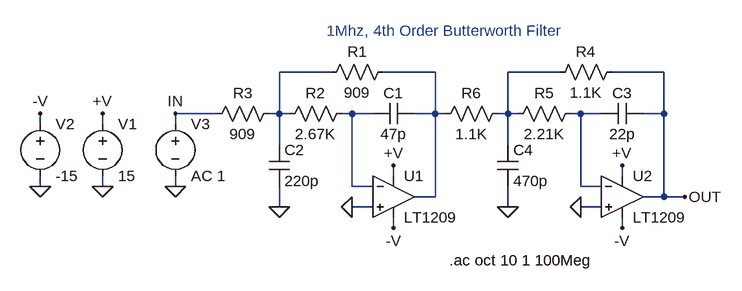
[diagram p0: schematic 1209.asc]
1209.asc, the LTspice schematic file:
Version 4
SHEET 1 896 680
WIRE 96 80 16 80
WIRE 256 80 176 80
WIRE 448 80 368 80
WIRE 608 80 528 80
WIRE -80 144 -144 144
WIRE 16 144 16 80
WIRE 16 144 0 144
WIRE 32 144 16 144
WIRE 128 144 112 144
WIRE 160 144 128 144
WIRE 256 144 256 80
WIRE 256 144 224 144
WIRE 272 144 256 144
WIRE 368 144 368 80
WIRE 368 144 352 144
WIRE 384 144 368 144
WIRE 480 144 464 144
WIRE 512 144 480 144
WIRE 608 144 608 80
WIRE 608 144 576 144
WIRE -352 160 -352 144
WIRE -256 160 -256 144
WIRE -144 160 -144 144
WIRE 16 192 16 144
WIRE 368 192 368 144
WIRE 192 240 192 224
WIRE 544 240 544 224
WIRE -352 256 -352 240
WIRE -256 256 -256 240
WIRE -144 256 -144 240
WIRE 128 256 128 144
WIRE 160 256 128 256
WIRE 480 256 480 144
WIRE 512 256 480 256
WIRE 256 272 256 144
WIRE 256 272 224 272
WIRE 608 272 608 144
WIRE 608 272 576 272
WIRE 640 272 608 272
WIRE 16 288 16 256
WIRE 160 288 128 288
WIRE 368 288 368 256
WIRE 512 288 480 288
WIRE 192 320 192 304
WIRE 544 320 544 304
FLAG -256 256 0
FLAG 192 224 +V
FLAG -256 144 +V
FLAG 192 320 -V
FLAG -352 256 0
FLAG -352 144 -V
FLAG -144 256 0
FLAG 128 288 0
FLAG 16 288 0
FLAG 544 224 +V
FLAG 544 320 -V
FLAG 480 288 0
FLAG 368 288 0
FLAG -144 144 IN
FLAG 640 272 OUT
SYMBOL voltage -256 144 R0
SYMATTR InstName V1
SYMATTR Value 15
SYMBOL voltage -352 144 R0
SYMATTR InstName V2
SYMATTR Value -15
SYMBOL res 192 64 R90
WINDOW 0 0 56 VBottom 0
WINDOW 3 32 56 VTop 0
SYMATTR InstName R1
SYMATTR Value 909
SYMBOL voltage -144 144 R0
SYMATTR InstName V3
SYMATTR Value AC 1
SYMBOL cap 224 128 R90
WINDOW 0 0 32 VBottom 0
WINDOW 3 32 32 VTop 0
SYMATTR InstName C1
SYMATTR Value 47p
SYMBOL res 128 128 R90
WINDOW 0 0 56 VBottom 0
WINDOW 3 32 56 VTop 0
SYMATTR InstName R2
SYMATTR Value 2.67K
SYMBOL res 16 128 R90
WINDOW 0 0 56 VBottom 0
WINDOW 3 32 56 VTop 0
SYMATTR InstName R3
SYMATTR Value 909
SYMBOL cap 0 192 R0
SYMATTR InstName C2
SYMATTR Value 220p
SYMBOL res 544 64 R90
WINDOW 0 0 56 VBottom 0
WINDOW 3 32 56 VTop 0
SYMATTR InstName R4
SYMATTR Value 1.1K
SYMBOL cap 576 128 R90
WINDOW 0 0 32 VBottom 0
WINDOW 3 32 32 VTop 0
SYMATTR InstName C3
SYMATTR Value 22p
SYMBOL res 480 128 R90
WINDOW 0 0 56 VBottom 0
WINDOW 3 32 56 VTop 0
SYMATTR InstName R5
SYMATTR Value 2.21K
SYMBOL cap 352 192 R0
SYMATTR InstName C4
SYMATTR Value 470p
SYMBOL res 368 128 R90
WINDOW 0 0 56 VBottom 0
WINDOW 3 32 56 VTop 0
SYMATTR InstName R6
SYMATTR Value 1.1K
SYMBOL opamps\\LT1209 192 208 R0
SYMATTR InstName U1
SYMBOL opamps\\LT1209 544 208 R0
SYMATTR InstName U2
TEXT 278 370 Left 0 !.ac oct 10 1 100Meg
TEXT 272 32 Bottom 0 ;1Mhz, 4th Order Butterworth Filter

The netlist it stands for:
* 1209.asc
V1 +V 0 15
V2 -V 0 -15
R1 N002 N001 909
V3 IN 0 AC 1
C1 N002 N004 47p
R2 N004 N001 2.67K
R3 N001 IN 909
C2 N001 0 220p
R4 OUT N003 1.1K
C3 OUT N005 22p
R5 N005 N003 2.21K
C4 N003 0 470p
R6 N003 N002 1.1K
XU1 0 N004 +V -V N002 LT1209  ; pins In+ In- V+ V- OUT
XU2 0 N005 +V -V OUT LT1209  ; pins In+ In- V+ V- OUT
.ac oct 10 1 100Meg
* 1Mhz, 4th Order Butterworth Filter
.backanno
.end